# EAGLE design LogicBoard (EAGLE 9.6.2)
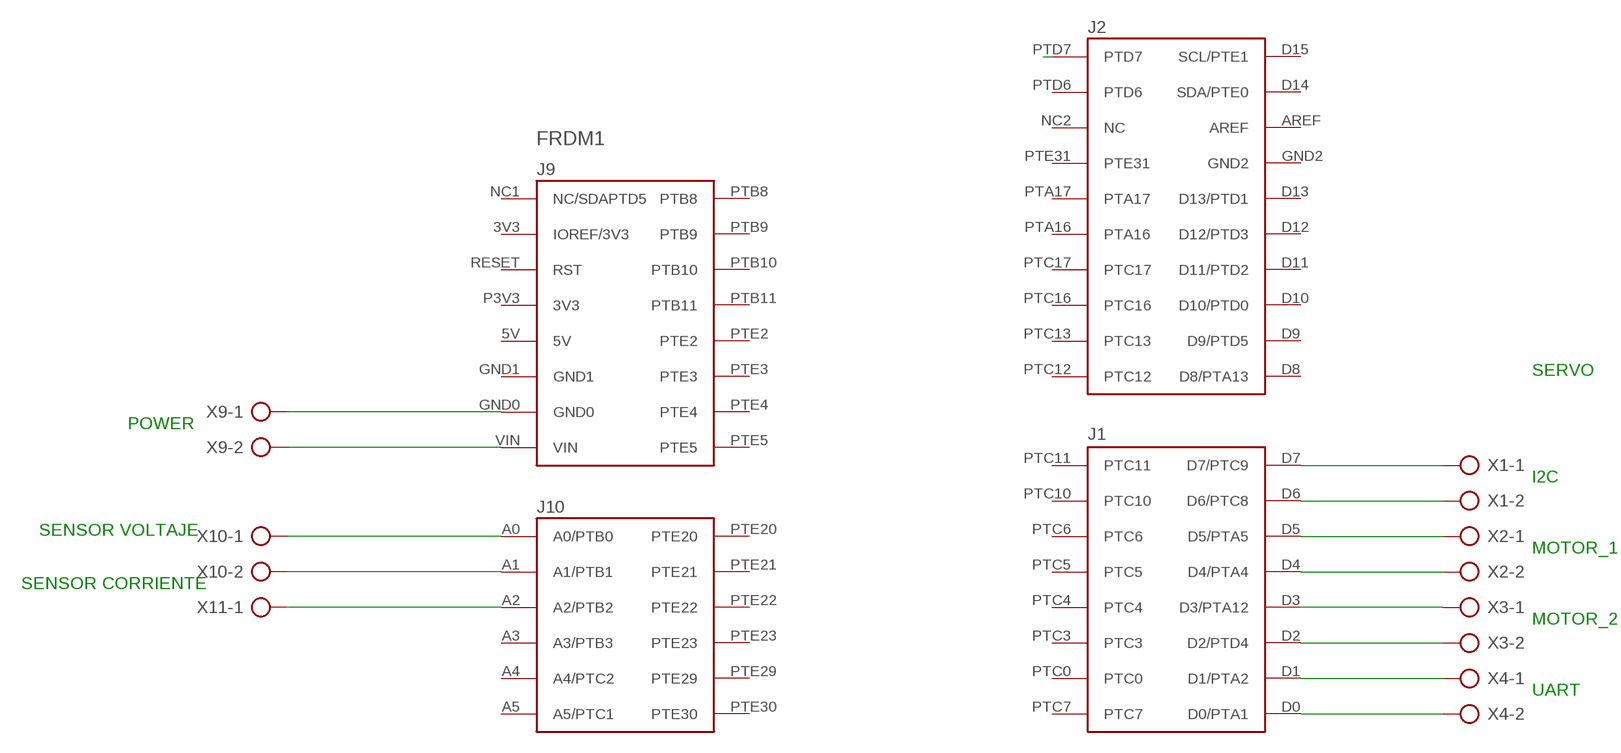
[diagram p0: schematic, sheet 1]

## Parts
FRDM1  FRDM-KL25ZNORMAL  [FRDM_KL25Z_NORMAL]
X1  AK500/2-H  [AK500/2-H]
X2  AK500/2-H  [AK500/2-H]
X3  AK500/2-H  [AK500/2-H]
X4  AK500/2-H  [AK500/2-H]
X9  AK500/2-H  [AK500/2-H]
X10  AK500/2-H  [AK500/2-H]
X11  AK500/2-H  [AK500/2-H]

## Nets
N$1: FRDM1.D7(D7/PTC9) X1.1
N$2: FRDM1.D6(D6/PTC8) X1.2
N$3: FRDM1.D5(D5/PTA5) X2.1
N$4: FRDM1.D4(D4/PTA4) X2.2
N$5: FRDM1.D3(D3/PTA12) X3.1
N$6: FRDM1.D2(D2/PTD4) X3.2
N$7: FRDM1.D1(D1/PTA2) X4.1
N$8: FRDM1.D0(D0/PTA1) X4.2
N$9: FRDM1.VIN X9.2
N$10: FRDM1.GND0 X9.1
N$11: FRDM1.A0(A0/PTB0) X10.1
N$12: FRDM1.A1(A1/PTB1) X10.2
N$13: FRDM1.A2(A2/PTB2) X11.1
N$20: FRDM1.PTD7
Unconnected: FRDM1.3V3(IOREF/3V3) FRDM1.5V FRDM1.A3(A3/PTB3) FRDM1.A4(A4/PTC2) FRDM1.A5(A5/PTC1) FRDM1.AREF FRDM1.D8(D8/PTA13) FRDM1.D9(D9/PTD5) FRDM1.D10(D10/PTD0) FRDM1.D11(D11/PTD2) FRDM1.D12(D12/PTD3) FRDM1.D13(D13/PTD1) FRDM1.D14(SDA/PTE0) FRDM1.D15(SCL/PTE1) FRDM1.GND1 FRDM1.GND2 FRDM1.NC1(NC/SDAPTD5) FRDM1.NC2(NC) FRDM1.P3V3(3V3) FRDM1.PTA16 FRDM1.PTA17 FRDM1.PTB8 FRDM1.PTB9 FRDM1.PTB10 FRDM1.PTB11 FRDM1.PTC0 FRDM1.PTC3 FRDM1.PTC4 FRDM1.PTC5 FRDM1.PTC6 FRDM1.PTC7 FRDM1.PTC10 FRDM1.PTC11 FRDM1.PTC12 FRDM1.PTC13 FRDM1.PTC16 FRDM1.PTC17 FRDM1.PTD6 FRDM1.PTE2 FRDM1.PTE3 FRDM1.PTE4 FRDM1.PTE5 FRDM1.PTE20 FRDM1.PTE21 FRDM1.PTE22 FRDM1.PTE23 FRDM1.PTE29 FRDM1.PTE30 FRDM1.PTE31 FRDM1.RESET(RST) X11.2

## Notes on the sheet
- SERVO
- POWER
- I2C
- SENSOR VOLTAJE
- MOTOR_1
- SENSOR CORRIENTE
- MOTOR_2
- UART

## Library data of the parts
FRDM1 = FRDM-KL25Z:FRDM-KL25Z: For creating FRDM-KL25Z shields Check availability <https://pricing.snapeda.com/parts/FRDM-KL25Z/NXP%20USA/view-part?ref=eda>; AVAILABILITY: In Stock; DESCRIPTION: KL1x, KL2x, mbed-Enabled Development Freedom Kinetis ARM® Cortex®-M0+ MCU 32-Bit Embedded Evaluation Board; MF: NXP USA; MP: FRDM-KL25Z; PACKAGE: None; PRICE: None; PURCHASE-URL: https://pricing.snapeda.com/search/part/FRDM-KL25Z/?ref=eda
X1-X4 X9-X11 = con-ptr500:AK500/2-H: CONNECTOR Aug. 2004 / PTR Meßtechnik: Die Bezeichnung der Serie AK505 wurde geändert. Es handelt sich hierbei um AK500 in horizontaler Ausführung.; OC_FARNELL: unknown; OC_NEWARK: unknown

## Board
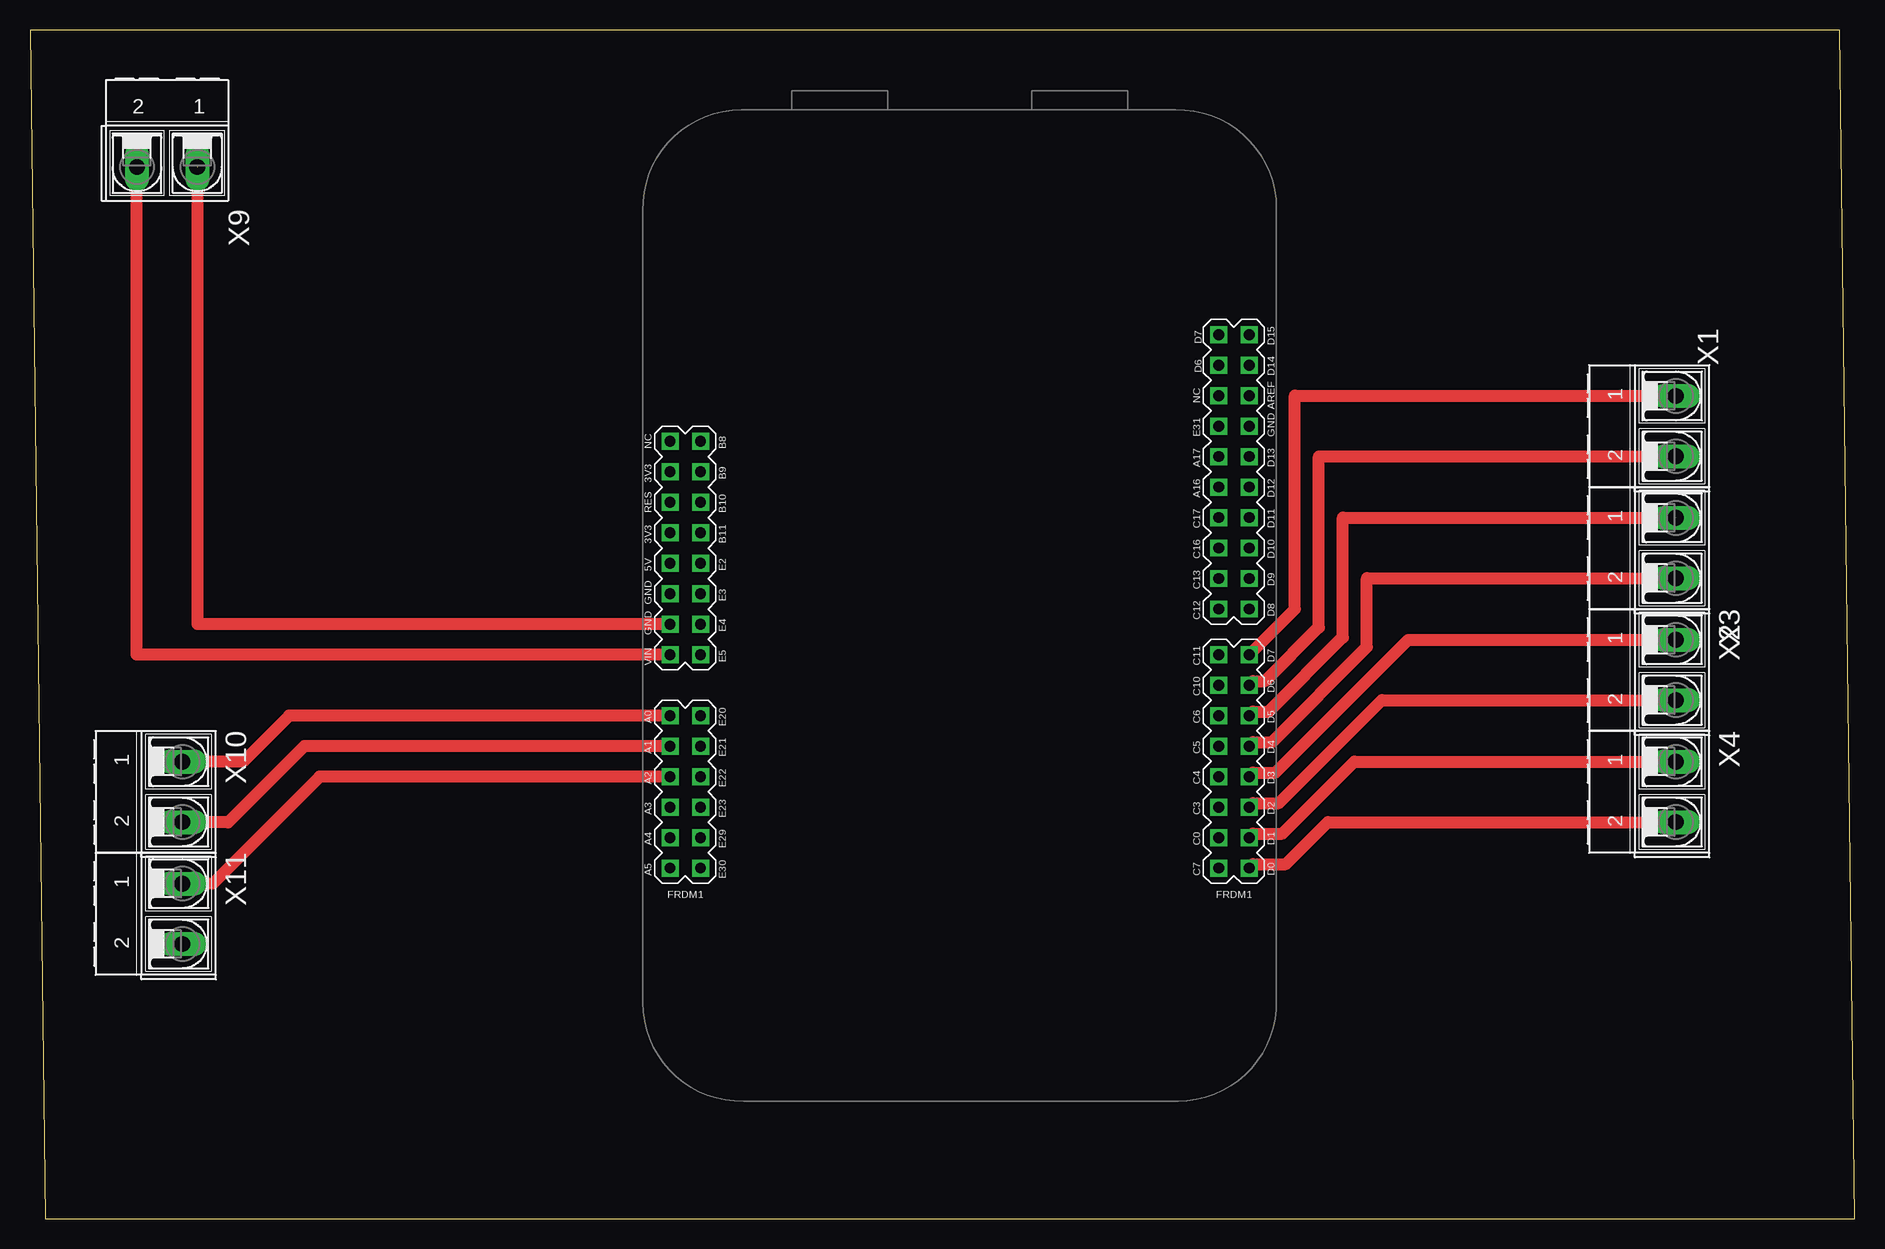
[diagram p1: board, top side]

Size 152.07 x 99.05 mm. Coordinates in mm from the lower left corner, seen from the top.
Outline: 1.27,0 152.07,0 150.8,99.05 0,99.05 1.27,0
Copper layers (1*16): Top 0.035mm / dielectric 1.5mm / Bottom 0.035mm
Design rules "default *": minimum track width 1mm, minimum drill 0.35mm, track to track 1mm, track to pad 1mm, pad to pad 6mil, via to via 6mil, smd to smd 6mil, copper to edge 40mil, drill to drill 6mil, minimum pad ring 10mil, minimum via ring 8mil, stop-mask expansion 4mil, vias tented up to drill 0mil, thermal gap 10mil

### Footprints (pad centres in the part's own frame; a part is rotated, then mirrored left to right if it is on the bottom)
FRDM_KL25Z_NORMAL = drill 0.9 square: 3V3 24.13,-15.24; 5V 24.13,-7.62; A0 24.13,5.08; A1 24.13,7.62; A2 24.13,10.16; A3 24.13,12.7; A4 24.13,15.24; A5 24.13,17.78; AREF -24.13,-21.59; D0 -24.13,17.78; D1 -24.13,15.24; D2 -24.13,12.7; D3 -24.13,10.16; D4 -24.13,7.62; D5 -24.13,5.08; D6 -24.13,2.54; D7 -24.13,0; D8 -24.13,-3.81; D9 -24.13,-6.35; D10 -24.13,-8.89; D11 -24.13,-11.43; D12 -24.13,-13.97; D13 -24.13,-16.51; D14 -24.13,-24.13; D15 -24.13,-26.67; GND0 24.13,-2.54; GND1 24.13,-5.08; GND2 -24.13,-19.05; NC1 24.13,-17.78; NC2 -21.59,-21.59; P3V3 24.13,-10.16; PTA16 -21.59,-13.97; PTA17 -21.59,-16.51; PTB8 21.59,-17.78; PTB9 21.59,-15.24; PTB10 21.59,-12.7; PTB11 21.59,-10.16; PTC0 -21.59,15.24; PTC3 -21.59,12.7; PTC4 -21.59,10.16; PTC5 -21.59,7.62; PTC6 -21.59,5.08; PTC7 -21.59,17.78; PTC10 -21.59,2.54; PTC11 -21.59,0; PTC12 -21.59,-3.81; PTC13 -21.59,-6.35; PTC16 -21.59,-8.89; PTC17 -21.59,-11.43; PTD6 -21.59,-24.13; PTD7 -21.59,-26.67; PTE2 21.59,-7.62; PTE3 21.59,-5.08; PTE4 21.59,-2.54; PTE5 21.59,0; PTE20 21.59,5.08; PTE21 21.59,7.62; PTE22 21.59,10.16; PTE23 21.59,12.7; PTE29 21.59,15.24; PTE30 21.59,17.78; PTE31 -21.59,-19.05; RESET 24.13,-12.7; VIN 24.13,0
AK500/2-H = drill 1.321 long: 1 -2.515,0; 2 2.515,0

### Placement (x,y rotation side)
FRDM1  77.47,46.99 180 top
X1  137.16,66.04 270 top
X2  137.16,55.88 270 top
X3  137.16,45.72 270 top
X4  137.16,35.56 270 top
X9  11.43,87.63 180 top
X10  12.7,35.56 270 top
X11  12.7,25.4 270 top

### Tracks (layer width: path | path; a pad name or v marks a point on that pad's centre or on a via)
N$1
  Top 1: FRDM1.D7 105.41,50.8 105.41,68.58 137.13,68.58 X1.1
N$2
  Top 1: FRDM1.D6 101.94,44.79 102.92,44.79 107.41,49.27 107.41,63.5 107.44,63.53 X1.2
N$3  (1 unrouted)
  Top 1: FRDM1.D5 101.94,42.25 103.21,42.25 109.41,48.44 109.41,58.42 137.16,58.42
N$4
  Top 1: FRDM1.D4 101.94,39.71 103.5,39.71 111.41,47.61 111.41,53.34 111.44,53.37 X2.2
N$5
  Top 1: FRDM1.D3 101.94,37.17 103.79,37.17 114.86,48.24 X3.1
N$6
  Top 1: FRDM1.D2 101.94,34.63 104.08,34.63 112.66,43.21 X3.2
N$7
  Top 1: FRDM1.D1 101.94,32.09 104.37,32.09 110.36,38.08 X4.1
N$8
  Top 1: FRDM1.D0 101.94,29.55 104.66,29.55 108.16,33.05 X4.2
N$9
  Top 1: FRDM1.VIN 8.89,46.99 8.89,87.6 X9.2
N$10  (1 unrouted)
  Top 1: FRDM1.GND0 13.97,49.53 13.97,87.63
N$11
  Top 1: FRDM1.A0 21.59,41.91 17.75,38.08 X10.1
N$12
  Top 1: FRDM1.A1 22.86,39.37 16.51,33.02 12.72,33.02 X10.2
N$13
  Top 1: FRDM1.A2 24.13,36.83 15.21,27.91 X11.1